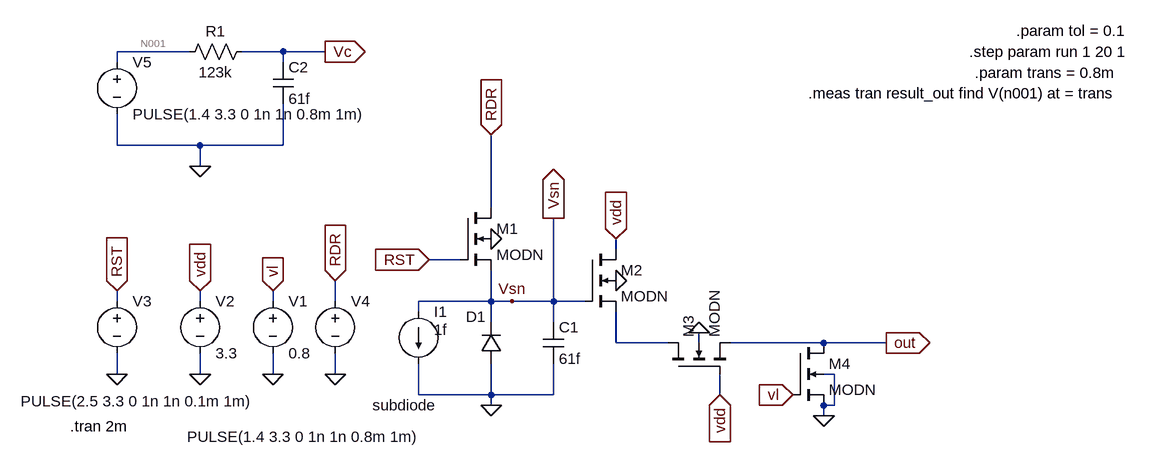
[diagram p0: schematic LIN LOG 2014 Resistor.asc]
LIN LOG 2014 Resistor.asc, the LTspice schematic file:
Version 4
SHEET 1 1392 680
WIRE -128 -224 -240 -224
WIRE 16 -224 -48 -224
WIRE 80 -224 16 -224
WIRE -240 -208 -240 -224
WIRE 16 -208 16 -224
WIRE -240 -80 -240 -128
WIRE -112 -80 -240 -80
WIRE 16 -80 16 -144
WIRE 16 -80 -112 -80
WIRE -112 -48 -112 -80
WIRE 336 16 336 -96
WIRE 528 80 528 64
WIRE 288 96 240 96
WIRE -240 160 -240 144
WIRE -112 160 -112 144
WIRE 0 160 0 144
WIRE 96 160 96 128
WIRE 336 160 336 112
WIRE 336 160 224 160
WIRE 368 160 336 160
WIRE 432 160 432 32
WIRE 432 160 368 160
WIRE 480 160 432 160
WIRE 224 176 224 160
WIRE 336 192 336 160
WIRE 432 192 432 160
WIRE 528 224 528 176
WIRE 608 224 528 224
WIRE 656 224 656 208
WIRE 848 224 704 224
WIRE 944 224 848 224
WIRE -240 272 -240 240
WIRE -112 272 -112 240
WIRE 0 272 0 240
WIRE 96 272 96 240
WIRE 864 272 848 272
WIRE 224 304 224 256
WIRE 336 304 336 256
WIRE 336 304 224 304
WIRE 432 304 432 256
WIRE 432 304 336 304
WIRE 688 304 688 272
WIRE 336 320 336 304
WIRE 848 320 848 304
WIRE 864 320 864 272
WIRE 864 320 848 320
WIRE 848 336 848 320
FLAG 240 96 RST
IOPIN 240 96 In
FLAG 0 272 0
FLAG -112 272 0
FLAG -240 272 0
FLAG -240 144 RST
IOPIN -240 144 In
FLAG 336 64 0
FLAG 336 320 0
FLAG 336 -96 RDR
IOPIN 336 -96 In
FLAG -112 144 vdd
IOPIN -112 144 In
FLAG 528 128 0
FLAG 848 336 0
FLAG 800 304 vl
IOPIN 800 304 In
FLAG 0 144 vl
IOPIN 0 144 In
FLAG 96 128 RDR
IOPIN 96 128 In
FLAG 96 272 0
FLAG 528 64 vdd
IOPIN 528 64 In
FLAG 656 208 0
FLAG 688 304 vdd
IOPIN 688 304 In
FLAG 944 224 out
IOPIN 944 224 Out
FLAG 368 160 Vsn
FLAG 432 32 Vsn
IOPIN 432 32 Out
FLAG -112 -48 0
FLAG 80 -224 Vc
IOPIN 80 -224 Out
SYMBOL voltage 0 144 R0
WINDOW 123 0 0 Left 2
WINDOW 39 0 0 Left 2
SYMATTR InstName V1
SYMATTR Value 0.8
SYMBOL voltage -112 144 R0
WINDOW 123 0 0 Left 2
WINDOW 39 0 0 Left 2
SYMATTR InstName V2
SYMATTR Value 3.3
SYMBOL voltage -240 144 R0
WINDOW 123 24 132 Left 2
WINDOW 39 0 0 Left 2
WINDOW 3 -148 170 Left 2
SYMATTR Value PULSE(2.5 3.3 0 1n 1n 0.1m 1m)
SYMATTR InstName V3
SYMBOL nmos4 288 16 R0
SYMATTR InstName M1
SYMATTR Value2 l={mc(0.35u,tol)} w={mc(0.70u,tol)}
SYMATTR Value MODN
SYMBOL nmos4 480 80 R0
SYMATTR InstName M2
SYMATTR Value2 l={mc(0.35u,tol)} w={mc(0.70u,tol)}
SYMATTR Value MODN
SYMBOL nmos4 800 224 R0
SYMATTR InstName M4
SYMATTR Value MODN
SYMBOL diode 352 256 R180
WINDOW 0 24 72 Left 2
WINDOW 3 100 -64 Left 2
SYMATTR InstName D1
SYMATTR Value subdiode
SYMBOL current 224 176 R0
WINDOW 3 24 28 Left 2
WINDOW 123 0 0 Left 2
WINDOW 39 0 0 Left 2
SYMATTR Value 1f
SYMATTR InstName I1
SYMBOL voltage 96 144 R0
WINDOW 123 0 0 Left 2
WINDOW 39 0 0 Left 2
WINDOW 3 -228 224 Left 2
SYMATTR Value PULSE(1.4 3.3 0 1n 1n 0.8m 1m)
SYMATTR InstName V4
SYMBOL nmos4 608 272 R270
SYMATTR InstName M3
SYMATTR Value2 l={mc(0.35u,tol)} w={mc(0.70u,tol)}
SYMATTR Value MODN
SYMBOL cap 416 192 R0
SYMATTR InstName C1
SYMATTR Value 61f
SYMBOL res -32 -240 R90
WINDOW 0 0 56 VBottom 2
WINDOW 3 32 56 VTop 2
SYMATTR InstName R1
SYMATTR Value 123k
SYMBOL cap 0 -208 R0
SYMATTR InstName C2
SYMATTR Value 61f
SYMBOL voltage -240 -224 R0
WINDOW 123 0 0 Left 2
WINDOW 39 0 0 Left 2
SYMATTR InstName V5
SYMATTR Value PULSE(1.4 3.3 0 1n 1n 0.8m 1m)
TEXT -312 352 Left 2 !.tran 2m
TEXT 1144 -256 Left 2 !.param tol = 0.1
TEXT 1072 -224 Left 2 !.step param run 1 20 1
TEXT 1080 -192 Left 2 !.param trans = 0.8m
TEXT 824 -160 Left 2 !.meas tran result_out find V(n001) at = trans

The netlist it stands for:
* LIN LOG 2014 Resistor.asc
V1 vl 0 0.8
V2 vdd 0 3.3
V3 RST 0 PULSE(2.5 3.3 0 1n 1n 0.1m 1m)
M1 RDR RST Vsn 0 MODN l={mc(0.35u,tol)} w={mc(0.70u,tol)}
M2 vdd Vsn N002 0 MODN l={mc(0.35u,tol)} w={mc(0.70u,tol)}
M4 out vl 0 0 MODN
D1 0 Vsn subdiode
I1 Vsn 0 1f
V4 RDR 0 PULSE(1.4 3.3 0 1n 1n 0.8m 1m)
M3 N002 vdd out 0 MODN l={mc(0.35u,tol)} w={mc(0.70u,tol)}
C1 Vsn 0 61f
R1 Vc N001 123k
C2 Vc 0 61f
V5 N001 0 PULSE(1.4 3.3 0 1n 1n 0.8m 1m)
.model D D
.lib standard.dio
.model NMOS NMOS
.model PMOS PMOS
.lib standard.mos
.tran 2m
.param tol = 0.1
.step param run 1 20 1
.param trans = 0.8m
.meas tran result_out find V(n001) at = trans
.backanno
.end